# Altium schematic sheet [00].HMS.Wifi.Controler.SchDoc
size A4; SheetNumber: 1; SheetTotal: 7
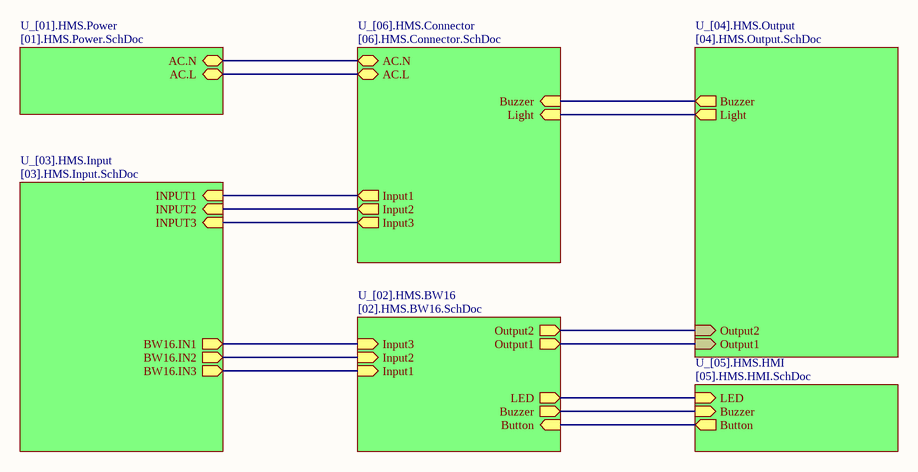
[diagram p0: [00].HMS.Wifi.Controler.SchDoc]

## Sub-sheets
U_[01].HMS.Power = [01].HMS.Power.SchDoc: AC.N (bidir), AC.L (bidir)
U_[02].HMS.BW16 = [02].HMS.BW16.SchDoc: Button (in), LED (out), Output2 (out), Output1 (out), Input3 (in), Input2 (in), Buzzer (out), Input1 (in)
U_[03].HMS.Input = [03].HMS.Input.SchDoc: INPUT1 (in), BW16.IN1 (out), INPUT2 (in), BW16.IN2 (out), INPUT3 (in), BW16.IN3 (out)
U_[04].HMS.Output = [04].HMS.Output.SchDoc: Output2 (in), Buzzer (out), Output1 (in), Light (out)
U_[05].HMS.HMI = [05].HMS.HMI.SchDoc: LED (in), Button (out), Buzzer (in)
U_[06].HMS.Connector = [06].HMS.Connector.SchDoc: AC.L (bidir), AC.N (bidir), Input1 (out), Input2 (out), Input3 (out), Buzzer (in), Light (in)

## Nets
(unnamed): sheet U_[02].HMS.BW16/Button, sheet U_[05].HMS.HMI/Button
(unnamed): sheet U_[02].HMS.BW16/LED, sheet U_[05].HMS.HMI/LED
(unnamed): sheet U_[02].HMS.BW16/Output2, sheet U_[04].HMS.Output/Output2
(unnamed): sheet U_[02].HMS.BW16/Output1, sheet U_[04].HMS.Output/Output1
(unnamed): sheet U_[02].HMS.BW16/Input3, sheet U_[03].HMS.Input/BW16.IN1
(unnamed): sheet U_[02].HMS.BW16/Input2, sheet U_[03].HMS.Input/BW16.IN2
(unnamed): sheet U_[02].HMS.BW16/Buzzer, sheet U_[05].HMS.HMI/Buzzer
(unnamed): sheet U_[02].HMS.BW16/Input1, sheet U_[03].HMS.Input/BW16.IN3
(unnamed): sheet U_[03].HMS.Input/INPUT1, sheet U_[06].HMS.Connector/Input1
(unnamed): sheet U_[03].HMS.Input/INPUT2, sheet U_[06].HMS.Connector/Input2
(unnamed): sheet U_[03].HMS.Input/INPUT3, sheet U_[06].HMS.Connector/Input3
(unnamed): sheet U_[04].HMS.Output/Buzzer, sheet U_[06].HMS.Connector/Buzzer
(unnamed): sheet U_[04].HMS.Output/Light, sheet U_[06].HMS.Connector/Light
(unnamed): sheet U_[06].HMS.Connector/AC.L, sheet U_[01].HMS.Power/AC.L
(unnamed): sheet U_[06].HMS.Connector/AC.N, sheet U_[01].HMS.Power/AC.N